# EAGLE design WeatherShield (EAGLE 7.3.0)
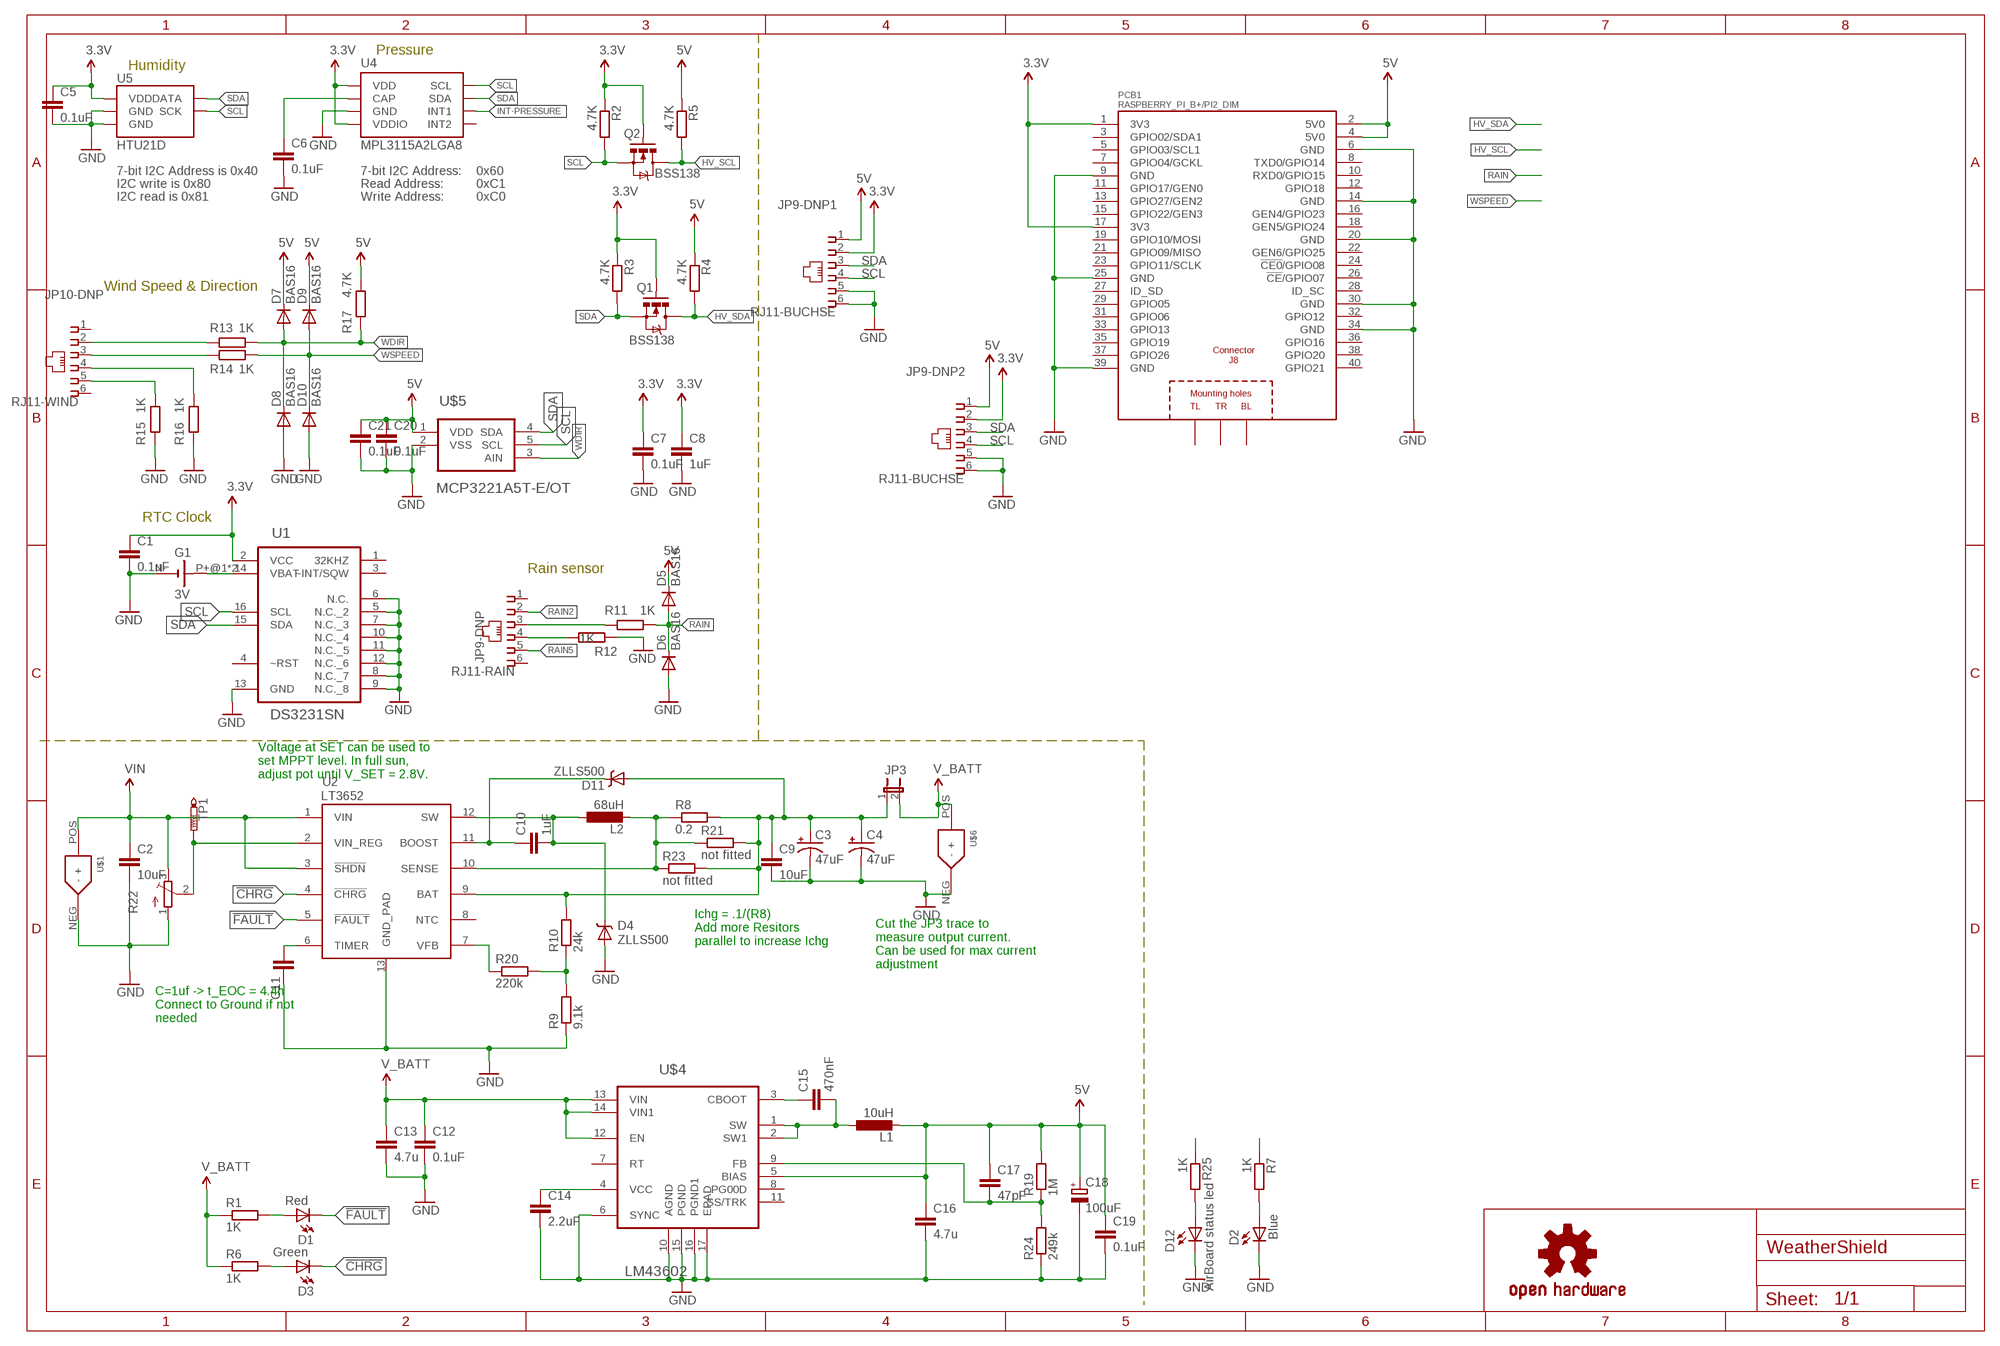
[diagram p0: schematic, sheet 1]

## Parts
C1  0.1uF  C-EUC0603  [C0603]
C2  10uF  C-EUC0603  [C0603]
C3  47uF  47UF-16V-10%(TANT)  [EIA7343-20]
C4  47uF  47UF-16V-10%(TANT)  [EIA7343-20]
C5  0.1uF  C-EUC0603  [C0603]
C6  0.1uF  C-EUC0603  [C0603]
C7  0.1uF  C-EUC0603  [C0603]
C8  1uF  C-EUC0603  [C0603]
C9  10uF  C-EUC0603  [C0603]
C10  1uF  C-EUC0603  [C0603]
C11  1.0uF  C-EUC0603  [C0603]
C12  0.1uF  C-EUC1206  [C1206]
C13  4.7u  C-EUC1206  [C1206]
C14  2.2uF  C-EUC0603  [C0603]
C15  470nF  C-EUC0603  [C0603]
C16  4.7u  C-EUC0603  [C0603]
C17  47pF  C-EUC0603  [C0603]
C18  100uF  CPOL-EUE2,5-6E  [E2,5-6E]
C19  0.1uF  C-EUC1206  [C1206]
C20  0.1uF  C-EUC0603  [C0603]
C21  0.1uF  C-EUC0603  [C0603]
D1  Red  LED0603  [LED-0603]
D2  Blue  LED0603  [LED-0603]
D3  Green  LED0603  [LED-0603]
D4  ZLLS500  ZLLS500ZLLS500  [SOT23]
D5  BAS16  DIODESOD  [SOD-323]
D6  BAS16  DIODESOD  [SOD-323]
D7  BAS16  DIODESOD  [SOD-323]
D8  BAS16  DIODESOD  [SOD-323]
D9  BAS16  DIODESOD  [SOD-323]
D10  BAS16  DIODESOD  [SOD-323]
D11  ZLLS500  ZLLS500ZLLS500  [SOT23]
D12  AirBoard status led  LED0603  [LED-0603]
G1  3V  BATTERY-HOLDER_11.6MM  [CELL_RETAINER_11.6MM]
JP3  JUMPER-PTH-2-NC  [PTH-JUMPER-NC_BOTTOM_NO_SILK]
JP9-DNP  RJ11-RAIN  RJ11-BUCHSE  [RJ11-STECKER]
JP9-DNP1  RJ11-BUCHSE  [RJ11-STECKER]
JP9-DNP2  RJ11-BUCHSE  [RJ11-STECKER]
JP10-DNP  RJ11-WIND  RJ11-BUCHSE  [RJ11-STECKER]
L1  10uH  L-EU6000-XXX-RC  [6000-XXXX-RC]
L2  68uH  L-EU6000-XXX-RC  [6000-XXXX-RC]
LOGO1  OSHW-LOGOM  [OSHW-LOGO-M]
PCB1  RASPBERRY_PI_B+/PI2_DIM  [RASPBERRY_PI_BPLUS_DIM]
Q1  BSS138  MOSFET-NCHANNELSMD  [SOT23-3]
Q2  BSS138  MOSFET-NCHANNELSMD  [SOT23-3]
R1  1K  R-EU_R0603  [R0603]
R2  4.7K  R-EU_R0603  [R0603]
R3  4.7K  R-EU_R0603  [R0603]
R4  4.7K  R-EU_R0603  [R0603]
R5  4.7K  R-EU_R0603  [R0603]
R6  1K  R-EU_R0603  [R0603]
R7  1K  R-EU_R0603  [R0603]
R8  0.2  R-EU_R0805  [R0805]
R9  9.1k  R-EU_R0603  [R0603]
R10  24k  R-EU_R0603  [R0603]
R11  1K  R-EU_R0603  [R0603]
R12  1K  R-EU_R0603  [R0603]
R13  1K  R-EU_R0603  [R0603]
R14  1K  R-EU_R0603  [R0603]
R15  1K  R-EU_R0603  [R0603]
R16  1K  R-EU_R0603  [R0603]
R17  4.7K  R-EU_R0603  [R0603]
R19  1M  R-EU_R0805  [R0805]
R20  220k  R-EU_R0603  [R0603]
R21  not fitted  R-EU_R0805  [R0805]
R22  TRIM_EU-SM-42/43A  [SM-42/43A]
R23  not fitted  R-EU_R0805  [R0805]
R24  249k  R-EU_R0805  [R0805]
R25  1K  R-EU_R0603  [R0603]
TP1  SET  PTR1B1,27  [B1,27]
U1  DS3231SN  [SOIC127P1032X265-16N]
U2  LT3652  [MSOP-12_GND]
U4  MPL3115A2LGA8  [LGA8]
U5  HTU21D  HTU21DSMD  [HTU21D]
U$1  XT-60  [XT-60]
U$4  LM43602  [HTSSOP-16]
U$5  MCP3221A5T-E/OT  [SOT95P270X145-5N]
U$6  XT-60  [XT-60]

## Nets
3.3V: C1.1 C5.1 C7.1 C8.1 JP9-DNP1.2 JP9-DNP2.2 PCB1.1(3V3) PCB1.17(3V3) Q1.1(G) Q2.1(G) R2.1 R3.1 U1.2(VCC) U4.1(VDD) U4.4(VDDIO) U5.VDD
5V: C16.1 C17.1 C18.+ C19.1 C20.1 C21.1 D5.1(C) D7.1(C) D9.1(C) JP9-DNP1.1 JP9-DNP2.1 L1.2 PCB1.2(5V0) PCB1.4(5V0) R4.1 R5.1 R17.1 R19.2 U$4.5(BIAS) U$5.1(VDD)
!CHRG: D3.C U2.4(!CHRG)
!FAULT: D1.C U2.5(!FAULT)
BOOST: C10.1 D11.3(C) U2.11(BOOST)
FB: R9.2 R10.1 R20.2
GND [vcc]: C1.2 C2.2 C3.C(-) C4.C(-) C5.2 C6.2 C7.2 C8.2 C9.2 C11.1 C12.2 C13.2 C14.2 C16.2 C18.- C19.2 C20.2 C21.2 D2.C D4.1(A) D6.2(A) D8.2(A) D10.2(A) D12.C G1.N-(-) JP9-DNP1.5 JP9-DNP1.6 JP9-DNP2.5 JP9-DNP2.6 PCB1.6(GND) PCB1.9(GND) PCB1.14(GND) PCB1.20(GND) PCB1.25(GND) PCB1.30(GND) PCB1.34(GND) PCB1.39(GND) R9.1 R12.2 R15.2 R16.2 R22.1(A) R24.1 U1.5(N.C._2) U1.6(N.C.) U1.7(N.C._3) U1.8(N.C._7) U1.9(N.C._8) U1.10(N.C._4) U1.11(N.C._5) U1.12(N.C._6) U1.13(GND) U2.13(GND_PAD) U4.3(GND) U5.7(GND) U5.GND U$1.NEG(-) U$4.6(SYNC) U$4.10(AGND) U$4.15(PGND) U$4.16(PGND1) U$4.17(EPAD) U$5.2(VSS) U$6.NEG(-)
HV_SCL: Q2.3(D) R5.2
HV_SDA: Q1.3(D) R4.2
INT-PRESSURE: U4.6(INT1)
N$1: JP10-DNP.3 R14.2
N$2: JP10-DNP.2 R13.2
N$3: D1.A R1.2
N$4: JP9-DNP.3 R11.2
N$5: C6.1 U4.2(CAP)
N$6: G1.P+@1(+) G1.P+@2(+) U1.14(VBAT)
N$7: D3.A R6.2
N$10: D2.A R7.2
N$11: JP9-DNP.4 R12.1
N$12: JP10-DNP.5 R15.1
N$13: JP10-DNP.4 R16.1
N$15: R20.1 U2.7(VFB)
N$16: C3.A(+) C4.A(+) C9.1 D11.1(A) JP3.1 R8.2 R10.2 R21.2 R23.2 U2.9(BAT)
N$17: C15.1 U$4.3(CBOOT)
N$22: C17.2 R19.1 R24.2 U$4.9(FB)
N$23: C14.1 U$4.4(VCC)
N$24: C15.2 L1.1 U$4.1(SW) U$4.2(SW1)
N$28: D12.A R25.2
RAIN: D5.2(A) D6.1(C) R11.1
RAIN2: JP9-DNP.2
RAIN5: JP9-DNP.5
SCL: JP9-DNP1.4 JP9-DNP2.4 Q2.2(S) R2.2 U1.16(SCL) U4.8(SCL) U5.SCK U$5.5(SCL)
SDA: JP9-DNP1.3 JP9-DNP2.3 Q1.2(S) R3.2 U1.15(SDA) U4.7(SDA) U5.DATA U$5.4(SDA)
SENSE: L2.2 R8.1 R21.1 R23.1 U2.10(SENSE)
SET: R22.2(S) TP1.TP U2.2(VIN_REG)
STAT1: R25.1
STAT3: R7.1
SW: C10.2 D4.3(C) L2.1 U2.12(SW)
TIMER: C11.2 U2.6(TIMER)
V_BATT: C12.1 C13.1 JP3.2 R1.1 R6.1 U$4.12(EN) U$4.13(VIN) U$4.14(VIN1) U$6.POS(+)
VIN: C2.1 R22.3(E) U2.1(VIN) U2.3(!SHDN) U$1.POS(+)
WDIR: D7.2(A) D8.1(C) R13.1 R17.2 U$5.3(AIN)
WSPEED: D9.2(A) D10.1(C) R14.1
Unconnected: JP9-DNP.1 JP9-DNP.6 JP10-DNP.1 JP10-DNP.6 PCB1.3(GPIO02/SDA1) PCB1.5(GPIO03/SCL1) PCB1.7(GPIO04/GCKL) PCB1.8(TXD0/GPIO14) PCB1.10(RXD0/GPIO15) PCB1.11(GPIO17/GEN0) PCB1.12(GPIO18) PCB1.13(GPIO27/GEN2) PCB1.15(GPIO22/GEN3) PCB1.16(GEN4/GPIO23) PCB1.18(GEN5/GPIO24) PCB1.19(GPIO10/MOSI) PCB1.21(GPIO09/MISO) PCB1.22(GEN6/GPIO25) PCB1.23(GPIO11/SCLK) PCB1.24(!CE0!/GPIO08) PCB1.26(!CE!/GPIO07) PCB1.27(ID_SD) PCB1.28(ID_SC) PCB1.29(GPIO05) PCB1.31(GPIO06) PCB1.32(GPIO12) PCB1.33(GPIO13) PCB1.35(GPIO19) PCB1.36(GPIO16) PCB1.37(GPIO26) PCB1.38(GPIO20) PCB1.40(GPIO21) PCB1.PE_BL(BL) PCB1.PE_TL(TL) PCB1.PE_TR(TR) U1.1(32KHZ) U1.3(~INT/SQW) U1.4(~RST) U2.8(NTC) U4.5(INT2) U$4.7(RT) U$4.8(PG00D) U$4.11(SS/TRK)

## Notes on the sheet
- Pressure
- Humidity
- 7-bit I2C Address is 0x40 | 7-bit I2C Address: | 0x60
- I2C write is 0x80 | Read Address: | 0xC1
- I2C read is 0x81 | Write Address: | 0xC0
- Wind Speed & Direction
- RTC Clock
- Rain sensor
- Voltage at SET can be used to
  set MPPT level. In full sun,
  adjust pot until V_SET = 2.8V.
- Ichg = .1/(R8)
  Add more Resitors 
  parallel to increase Ichg
- Cut the JP3 trace to
  measure output current.
  Can be used for max current
  adjustment
- C=1uf -> t_EOC = 4.4h
  Connect to Ground if not 
  needed

## Library data of the parts
C1 C2 C5-C17 C19-C21 = rcl:C-EU: CAPACITOR, European symbol
C3 C4 = FSEWeatherShield:47UF-16V-10%(TANT)
C18 = rcl:CPOL-EU: POLARIZED CAPACITOR, European symbol
D1-D3 D12 = SparkFun:LED: LEDs Standard schematic elements and footprints for 5mm, 3mm, 1206, and 0603 sized LEDs. 5mm - Spark Fun Electronics SKU : COM-00529 (and others)
D4 D11 = SparkFun-DiscreteSemi:ZLLS500: 700mA 40V SOT-23 Schottky; PROD_ID: DIO-08411
D5-D10 = SparkFun:DIODE: Diode These are standard reverse protection diodes and small signal diodes. SMA package can handle up to about 1A. SOD-323 can handle about 200mA. What the SOD-323 package when ordering, there are some mfgs out there that are 5-pin packages.
G1 = battery:BATTERY-HOLDER_11.6MM: 11.6mm PC BUTTON CELL RETAINER, high 5.97mm KEYSTONE ELECTRONICS CORP. Data sheet <http://www.farnell.com/cad/1718310.pdf>; MF: KEYSTONE; MPN: 2997; OC_FARNELL: 2293265
JP3 = SparkFun-Passives:JUMPER-PTH-2-NC
JP9-DNP JP9-DNP1 JP9-DNP2 JP10-DNP = FSEWeatherShield:RJ11-BUCHSE
L1 L2 = rcl:L-EU: INDUCTOR, European symbol
LOGO1 = SparkFun-Aesthetics:OSHW-LOGO: Open Source Hardware Logo This logo indicates the piece of hardware it is found on incorporates a OSHW license and/or adheres to the definition of open source hardware found here: http://freedomdefined.org/OSHW
PCB1 = FSE_Weather_Shield:RASPBERRY_PI_B+/PI2: Raspberry Pi B+ Basedon issue: Thursday, July 10, 2014 - Rev 1.2 LBR by Tim Rettmann 07-2014
Q1 Q2 = SparkFun:MOSFET-NCHANNEL
R1-R17 R19-R21 R23-R25 = rcl:R-EU_: RESISTOR, European symbol
R22 = pot:TRIM_EU-: POTENTIOMETER
TP1 = testpad:PTR1: TEST PIN
U1 = FSE_Weather_Shield:DS3231SN: Extremely Accurate I2C-Integrated RTC/TCXO/Crystal; MPN: DS3231SN#; OC_FARNELL: 1593292; OC_NEWARK: 68K3406; PACKAGE: SOIC-16; SUPPLIER: Maxim
U2 = SparkFun-PowerIC:LT3652: LT3652 MPPT Solar Charge Controller 5V-32V smart charger for batteries up to 14.4V
U4 = SparkFun-Sensors:MPL3115A2: Altimeter/Pressure Sensor, I2C, 1.95V-3.6V supply, 50 to 110kPa
U5 = SparkFun-Sensors:HTU21D
U$1 U$6 = FSEWeatherShield:XT-60
U$4 = FSEWeatherShield:LM43602
U$5 = FSEWeatherShield:MCP3221A5T-E/OT: A/D Converter; MPN: MCP3221A5T-E/OT; OC_FARNELL: 1332098; OC_NEWARK: 34M7446; PACKAGE: SOT-5; SUPPLIER: Microchip

## Net classes
1 vcc: width 0.203 mm

## Board
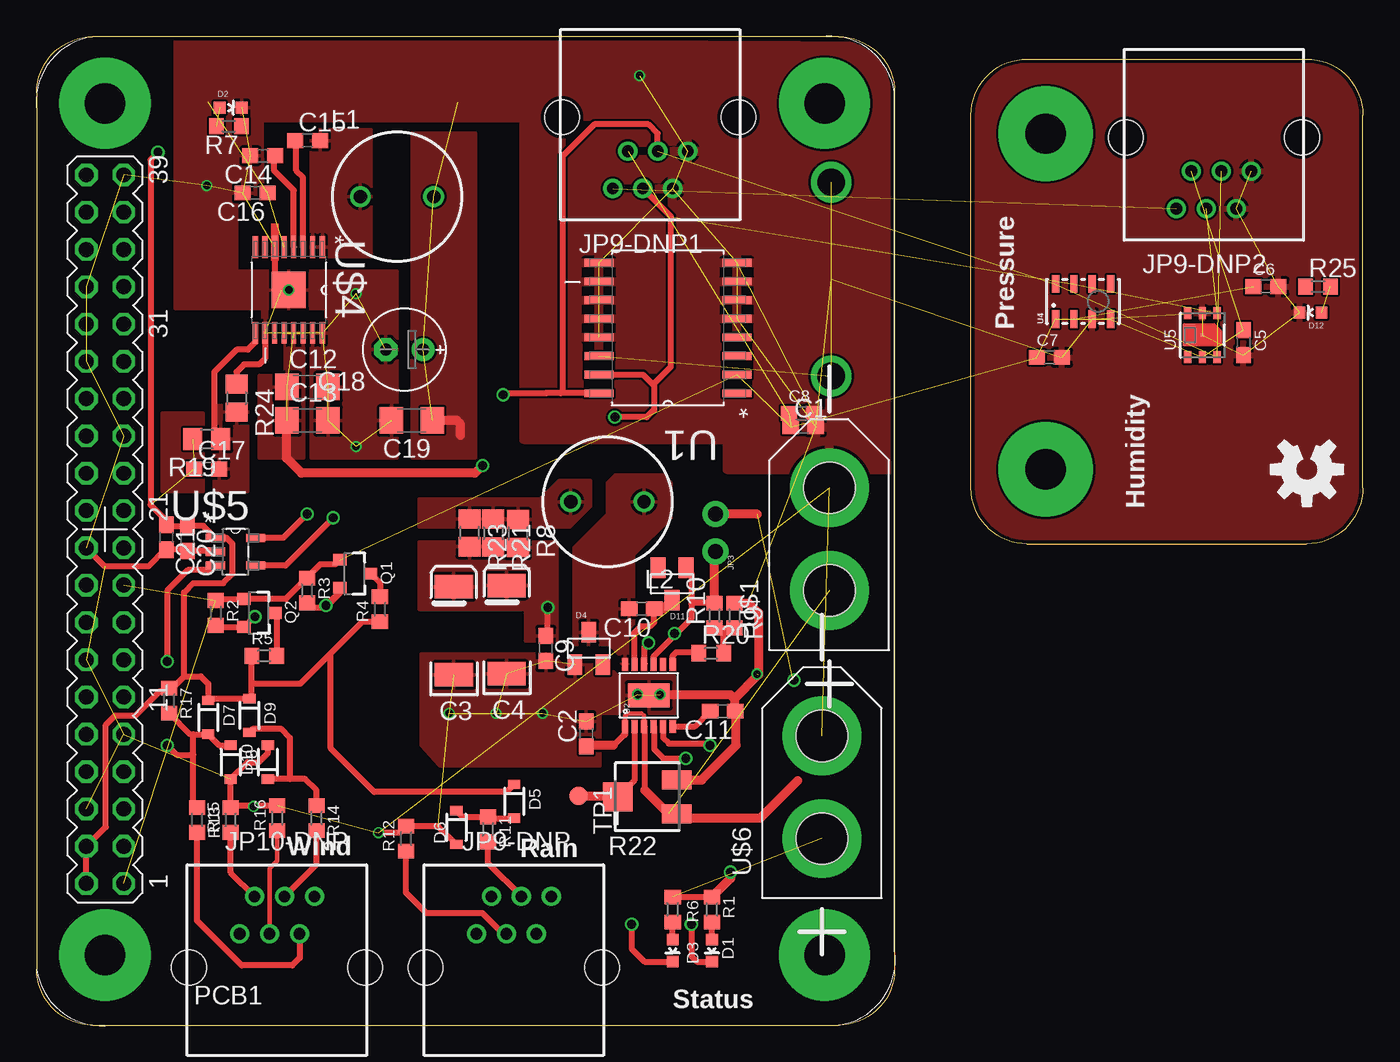
[diagram p1: board, top side]
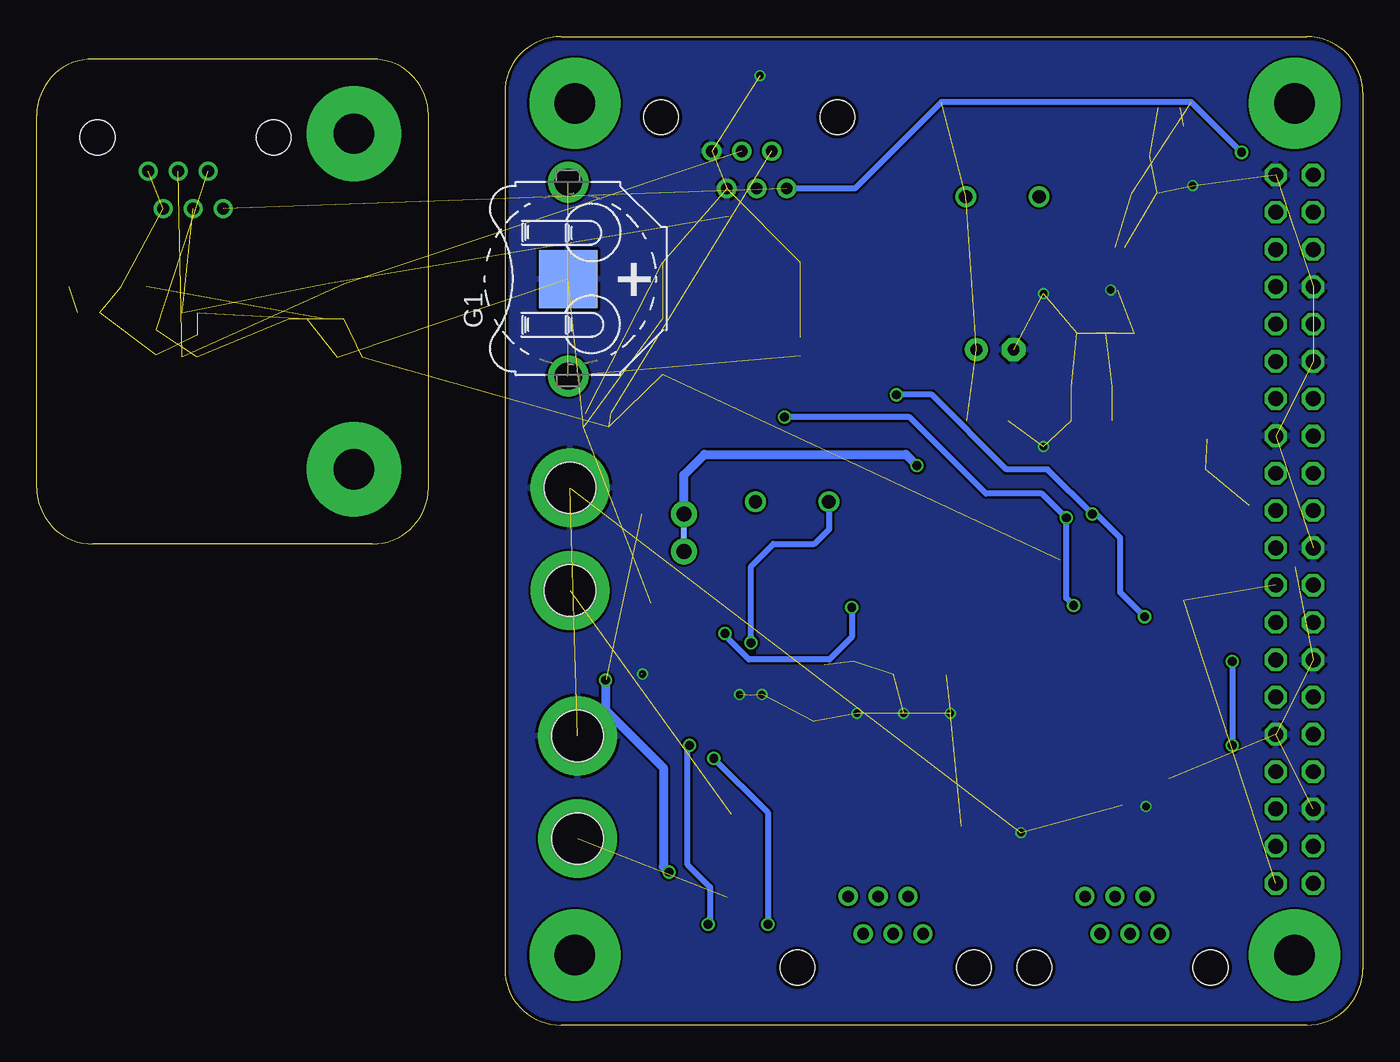
[diagram p2: board, bottom side, seen from below]

Size 90.3 x 67.31 mm. Coordinates in mm from the lower left corner, seen from the top.
Outline: 67.44,65.79 86.49,65.79 arc-90 90.3,61.98 90.3,36.58 arc-90 86.49,32.77 67.44,32.77 arc-90 63.63,36.58 63.63,61.98 arc-90 67.44,65.79
Outline: 3.81,0 arc-90 0,3.81 0,63.5 arc-90 3.81,67.31 54.61,67.31 arc-90 58.42,63.5 58.42,3.81 arc-90 54.61,0 3.81,0
Copper layers (1*16): Top 0.018mm / dielectric 1.55mm / Bottom 0.018mm
Design rules "eC_2Layer_PClass6_BaseCopperO18_eCDefault": minimum track width 0.15mm, minimum drill 0.35mm, track to track 0.15mm, track to pad 0.15mm, pad to pad 0.15mm, via to via 0.15mm, smd to smd 0mil, copper to edge 0.25mm, drill to drill 0.35mm, minimum pad ring 0.175mm, minimum via ring 0.125mm, stop-mask expansion 0mil, vias tented up to drill 0.45mm, thermal gap 0.2mm

### Footprints (pad centres in the part's own frame; a part is rotated, then mirrored left to right if it is on the bottom)
C0603 = smd 1.1 x 1: 1 -0.85,0; 2 0.85,0
EIA7343-20 = smd 1.6 x 2.6: A 3,0; C -3,0
C1206 = smd 1.6 x 1.8: 1 -1.4,0; 2 1.4,0
E2,5-6E = drill 0.813 pad 1.575: + -1.27,0 | drill 0.813 pad 1.575 octagon: - 1.27,0
LED-0603 = smd 0.8 x 0.8: A 0,-0.75; C 0,0.75
SOT23 = smd 1 x 1.4: 1 -0.95,-1.1; 2 0.95,-1.1; 3 0,1.1
SOD-323 = smd 0.63 x 0.83: 1 -1.15,0; 2 1.15,0
CELL_RETAINER_11.6MM = smd 3.96 x 3.96: N- 0,0 | drill 1.85 pad 2.54: P+@1 -6.605,0; P+@2 6.605,0
PTH-JUMPER-NC_BOTTOM_NO_SILK = drill 1.016 pad 1.778: 1 -1.27,0; 2 1.27,0 | smd 1.27 x 0.381 bottom: P$1 0,0
RJ11-STECKER = drill 0.8 pad 1.3: 1 8.65,10.84; 2 7.63,8.3; 3 6.61,10.84; 4 5.59,8.3; 5 4.57,10.84; 6 3.55,8.3 | hole 2.36: 0.1,6; 12.1,6
6000-XXXX-RC = drill 0.9 pad 1.422: 1 -2.5,0; 2 2.5,0
RASPBERRY_PI_BPLUS_DIM = drill 1.016 octagon: 1 9.64,52.5; 2 9.64,55.04; 3 12.18,52.5; 4 12.18,55.04; 5 14.72,52.5; 6 14.72,55.04; 7 17.26,52.5; 8 17.26,55.04; 9 19.8,52.5; 10 19.8,55.04; 11 22.34,52.5; 12 22.34,55.04; 13 24.88,52.5; 14 24.88,55.04; 15 27.42,52.5; 16 27.42,55.04; 17 29.96,52.5; 18 29.96,55.04; 19 32.5,52.5; 20 32.5,55.04; 21 35.04,52.5; 22 35.04,55.04; 23 37.58,52.5; 24 37.58,55.04; 25 40.12,52.5; 26 40.12,55.04; 27 42.66,52.5; 28 42.66,55.04; 29 45.2,52.5; 30 45.2,55.04; 31 47.74,52.5; 32 47.74,55.04; 33 50.28,52.5; 34 50.28,55.04; 35 52.82,52.5; 36 52.82,55.04; 37 55.36,52.5; 38 55.36,55.04; 39 57.9,52.5; 40 57.9,55.04 | drill 2.75 pad 6.2: PE_BL 4.77,4.77; PE_TL 4.77,53.77; PE_TR 62.77,53.77; PE_TR1 62.77,4.77
SOT23-3 = smd 0.8 x 0.9: 1 -0.95,-1; 2 0.95,-1; 3 0,1.1
R0603 = smd 1 x 1.1: 1 -0.85,0; 2 0.85,0
R0805 = smd 1.3 x 1.5: 1 -0.95,0; 2 0.95,0
SM-42/43A = smd 2 x 1.3: 1 2,1.15; 3 2,-1.15 | smd 2 x 2: 2 -2,0
B1,27 = smd 1.27 x 1.27: TP 0,0
SOIC127P1032X265-16N = smd 1.981 x 0.533: 1 -4.699,4.445; 2 -4.699,3.175; 3 -4.699,1.905; 4 -4.699,0.635; 5 -4.699,-0.635; 6 -4.699,-1.905; 7 -4.699,-3.175; 8 -4.699,-4.445; 9 4.699,-4.445; 10 4.699,-3.175; 11 4.699,-1.905; 12 4.699,-0.635; 13 4.699,0.635; 14 4.699,1.905; 15 4.699,3.175; 16 4.699,4.445
MSOP-12_GND = smd 0.889 x 0.42: 1 -2.1,1.625; 2 -2.1,0.975; 3 -2.1,0.325; 4 -2.1,-0.325; 5 -2.1,-0.975; 6 -2.1,-1.625; 7 2.1,-1.625; 8 2.1,-0.975; 9 2.1,-0.325; 10 2.1,0.325; 11 2.1,0.975; 12 2.1,1.625 | smd 1.651 x 2.845: 13 0,0
LGA8 = smd 1.2 x 0.5: 1 -1.2,1.875; 2 -1.2,0.625; 3 -1.2,-0.625; 4 -1.2,-1.875; 5 1.2,-1.875; 6 1.2,-0.625; 7 1.2,0.625; 8 1.2,1.875
HTU21D = smd 0.2 x 0.2: 7 0,0 | smd 0.8 x 0.5: DATA 1.5,-1; GND 1.5,0; NC@1 -1.5,1; NC@6 1.5,1; SCK -1.5,-1; VDD -1.5,0
XT-60 = drill 3.58: NEG 7,0; POS 0,0 | hole 3.5: 0,0; 7,0
HTSSOP-16 = smd 1.473 x 0.356: 1 -2.921,2.286; 2 -2.921,1.626; 3 -2.921,0.965; 4 -2.921,0.33; 5 -2.921,-0.33; 6 -2.921,-0.965; 7 -2.921,-1.626; 8 -2.921,-2.286; 9 2.921,-2.286; 10 2.921,-1.626; 11 2.921,-0.965; 12 2.921,-0.33; 13 2.921,0.33; 14 2.921,0.965; 15 2.921,1.626; 16 2.921,2.286 | smd 2.464 x 2.311: 17 0,0
SOT95P270X145-5N = smd 1.321 x 0.559: 1 -1.372,0.94; 2 -1.372,0; 3 -1.372,-0.94; 4 1.372,-0.94; 5 1.372,0.94

### Placement (x,y rotation side)
C1  52.2,40.74 0 top
C2  37.41,19.84 90 top
C3  28.4,26.85 90 top
C4  32,26.92 90 top
C5  82.17,46.48 270 top
C6  83.69,50.29 0 top
C7  68.96,45.47 0 top
C8  52.07,41.66 0 top
C9  34.67,25.65 270 top
C10  41.2,28.35 180 top
C11  46.71,21.39 180 top
C12  18.44,43.46 0 top
C13  18.44,41.17 0 top
C14  15.39,59.21 180 top
C15  18.44,60.22 0 top
C16  14.88,56.67 180 top
C17  11.58,37.87 0 top
C18  25.04,46 180 top
C19  25.55,41.17 180 top
C20  10.26,33.15 270 top
C21  8.84,33.22 270 top
D1  45.97,5.08 180 top
D2  13.21,62.48 270 top
D3  43.31,5.08 180 top
D4  37.59,25.65 0 top
D5  32.51,15.24 270 top
D6  28.57,13.46 270 top
D7  11.68,20.95 270 top
D8  13.21,17.91 270 top
D9  14.48,21.08 270 top
D10  15.75,17.91 90 top
D11  43.26,30.05 180 top
D12  86.74,48.51 90 top
G1  54.1,50.8 90 bottom
JP3  46.23,33.53 90 top
JP9-DNP  26.39,-2.08 0 top
JP9-DNP1  47.88,67.82 180 top
JP9-DNP2  86.26,66.45 180 top
JP10-DNP  10.26,-2.08 0 top
L1  24.54,56.41 0 top
L2  38.86,35.64 180 top
LOGO1  86.49,37.85 180 top
PCB1  58.42,0 90 top
Q1  21.64,30.73 270 top
Q2  15.11,28.07 270 top
R1  45.97,7.87 270 top
R2  12.19,28.07 270 top
R3  18.41,29.59 270 top
R4  23.37,28.32 90 top
R5  15.49,25.15 0 top
R6  43.31,7.87 270 top
R7  13.08,61.21 180 top
R8  32.77,33.48 270 top
R9  47.52,27.89 270 top
R10  46.15,27.89 90 top
R11  30.73,13.34 270 top
R12  25.15,12.7 90 top
R13  10.92,13.97 270 top
R14  19.05,14.1 270 top
R15  13.21,13.97 90 top
R16  16.38,14.1 90 top
R17  9.02,22.1 270 top
R19  11.58,39.9 180 top
R20  45.92,25.32 0 top
R21  31.09,33.5 270 top
R22  41.58,15.54 0 top
R23  29.46,33.53 270 top
R24  13.61,42.7 270 top
R25  87.25,50.29 0 top
TP1  36.88,15.62 270 top
U1  42.98,47.47 180 top
U2  41.68,22.45 90 top
U4  71.25,49.28 90 top
U5  79.38,46.99 90 top
U$1  53.98,29.59 90 top
U$4  17.17,50.06 270 top
U$5  13.54,32.23 0 top
U$6  53.47,12.7 90 top

### Tracks (layer width: path | path; a pad name or v marks a point on that pad's centre or on a via)
3.3V  (12 unrouted)
  Top 0.406: R2.1 12.29,29.02 Q2.1 16.95,29.02 18.41,30.48 | Q1.1 20.33,31.37 19.3,31.37 18.41,30.48 | 18.41,30.48 R3.1
5V  (via drill 0.6)  (8 unrouted)
  Top 0.406: PCB1.2 PCB1.4 4.7,13.5 4.7,20.45 5.33,21.08 6.73,21.08 8.38,22.73 8.8,22.73 | 14.64,23.24 14.64,22.4 D9.1 11.81,22.23 D7.1 11.68,23.24 11.18,23.75 10.03,23.75 | 14.64,23.24 R5.1 | 14.64,23.24 17.95,23.24 20.02,25.32 | 9.27,22.95 R17.1 | 20.02,25.32 22.18,27.47 R4.1 | 10.03,23.75 10.03,29.46 10.67,30.1 12.7,30.1 13.34,30.73 13.34,32.77 12.93,33.17 U$5.1 11.34,34 C20.1 8.91,34 C21.1 8.84,34.34 7.75,35.43 7.75,58.93 v8.26,59.44 | 10.03,23.75 9.4,23.11 | 9.4,23.11 9.23,22.95 | 9.23,22.95 R17.1 | R17.1 9.02,23.11 9.4,23.11 | 8.8,22.73 R17.1 | 8.8,22.73 9.02,22.73 9.23,22.95 | D5.1 32,15.88 22.99,15.88 20.02,18.84 20.02,25.32
  Bottom 0.406: v8.26,59.44 11.68,62.87 28.7,62.87 34.59,56.98 JP9-DNP1.1
!CHRG  (via drill 0.6)
  Top 0.406: U2.4 42.04,20.32 42.04,18.8 42.67,18.16 v44.2,18.16 | v40.51,6.86 40.51,5.21 41.4,4.32 43.3,4.32 D3.C
  Bottom 0.406: v44.2,18.16 40.51,14.48 v40.51,6.86
!FAULT  (via drill 0.6)
  Top 0.406: U2.5 42.66,19.57 43.05,19.18 45.72,19.18 v45.85,19.05 | v44.58,6.86 44.58,4.7 44.96,4.32 45.96,4.32 D1.C
  Bottom 0.406: v44.58,6.86 44.45,6.99 44.45,9.4 45.97,10.92 45.97,18.92 v45.85,19.05
+5V
  Top 0.61: 28.85,40.16 28.85,40.92 28.6,41.17 26.82,41.17
  pour Top: 25.55,38.63 25.55,60.73 29.87,60.73 29.87,38.63
  pour Top: 11.33,41.68 11.33,36.35 8.53,36.35 8.53,41.68
BOOST
  Top 0.406: U2.11 40.71,26.74 41.15,27.18 41.78,27.18 42.04,27.43 42.04,28.34 C10.1
  Top 0.61: C10.1 42.65,28.35 D11.3
FB
  Top 0.406: R10.1 46.99,27.04 | 46.99,27.04 R9.2 | R20.2 46.77,26.82 46.99,27.04
GND  (via drill 0.5 pad 0.25)  (61 unrouted)
  Top 0.406: U$4.6 16.2,50.52 16.66,50.06 U$4.17 | U$4.10 15.54,45.39 15.14,44.98 14.12,44.98 13.61,44.48 R24.1 | U$5.2 12.1,32.3 C20.2 10.19,32.37 C21.2 8.75,32.37 7.62,31.24 4.64,31.24 PCB1.20 | D10.2 15.75,18.54 15.11,17.91 14.36,17.91 D8.2 R15.2 13.34,14.95 14.7,14.95 | 14.7,14.95 R16.2 | 14.7,14.95 v14.76,14.88 | D6.2 27.34,13.55 R12.2 24.7,13.11 v23.27,13.11
  Top 0.61: R22.1 45.27,16.7 47.62,19.05 47.62,21.32 C11.1 47.5,21.45 47.5,22.23 | v42.44,22.5 47.22,22.5 47.5,22.23 | R9.1 48.48,28.74 49.15,28.07 49.15,23.88 47.5,22.23
  other vias: 17.17,50.06 21.74,39.4 21.74,49.81 11.58,57.18 41.05,64.67 28.09,21.23 31.27,21.23 34.44,21.23 40.92,22.5 49.05,23.9
  pour Bottom: -1.27,68.58 59.69,68.58 59.69,-1.27 -1.27,-1.27
  pour Top: 62.36,32.77 62.61,66.04 90.55,66.04 90.3,32.77
  pour Top: 18.69,47.78 18.69,38.63 24.54,38.63 24.54,51.33 13.61,51.33 13.61,56.67 15.39,56.54 15.37,61.59 34.32,61.57 34.32,67.08 9.42,67.08 9.42,48.79 15.39,48.79 15.39,47.78 15.65,47.78 15.65,48.79 19.71,48.79 19.71,47.78
  pour Top: 43.43,21.21 43.43,23.75 39.62,23.75 38.86,24.51 35.81,24.51 35.05,25.27 26.16,25.27 26.16,19.05 27.43,17.65 38.35,17.65 38.35,21.21
  pour Top: 33.15,66.8 33.15,39.88 46.99,39.88 46.99,37.85 58.29,37.85 58.29,66.67
HV_SCL
  Top 0.406: Q2.3 16.34,27.94 R5.2
HV_SDA
  Top 0.406: Q1.3 23.37,30.11 R4.2
N$1
  Top 0.406: JP10-DNP.3 19.05,10.94 R14.2
N$2
  Top 0.406: JP10-DNP.2 17.91,6.2 17.91,4.57 17.4,4.06 13.97,4.06 10.92,7.11 R13.2
N$3
  Top 0.406: D1.A R1.2
N$4
  Top 0.406: JP9-DNP.3 30.73,11.02 R11.2
N$5  (1 unrouted)
N$6  (2 unrouted)
N$7
  Top 0.406: D3.A R6.2
N$8  (via drill 2.75 pad 6.45)
  other vias: 68.71,37.85
N$9  (via drill 2.75 pad 6.45)
  other vias: 68.71,60.71
N$10  (1 unrouted)
N$11
  Top 0.406: JP9-DNP.4 31.76,6.22 30.35,7.62 26.54,7.62 25.15,9.02 R12.1
N$12
  Top 0.406: JP10-DNP.5 13.21,10.38 R15.1
N$13
  Top 0.305: JP10-DNP.4 15.88,6.24 15.88,10.67 16.38,11.18 R16.1
N$15
  Top 0.406: U2.7 43.31,25.15 43.56,25.4 45,25.4 R20.1
N$16  (via drill 0.6)  (1 unrouted)
  Top 0.406: U2.9 42.01,25.11 44.58,27.69 44.58,28.7 | D11.1 44.58,30.78 44.58,28.7 | R10.2 44.61,28.74 44.58,28.7 | C9.1 34.8,26.5 v34.8,28.45
  Top 0.61: R10.2 46.15,32.18 JP3.1
  Bottom 0.406: v34.8,28.45 34.8,26.42 36.32,24.89 41.78,24.89 42.01,25.11 43.5,26.61 v43.43,26.67
  pour Top: 26.04,28.32 26.04,32.89 35.43,32.89 35.43,26.16 33.27,26.16 33.27,28.32
N$17
  Top 0.406: U$4.3 18.14,57.73 17.68,58.19 17.68,60.13 C15.1
N$22
  Top 0.406: 13.55,41.68 R24.2 | U$4.9 14.88,46.51 14.38,46 13.61,46 12.09,44.48 12.09,40.34 R19.1
  pour Top: 14.38,42.19 12.09,42.19 12.09,36.35 14.38,36.35
N$23
  Top 0.406: U$4.4 17.5,56.84 16.15,58.19 16.15,59.12 C14.1
N$24
  pour Top: 18.69,52.35 18.69,60.99 22.76,60.99 22.76,52.35
N$28  (1 unrouted)
RAIN
  Top 0.406: D6.1 29,14.19 R11.1 30.83,14.09 D5.2
SCL  (via drill 0.6)  (3 unrouted)
  Top 0.406: 31.85,43.03 34.7,43.03 | v18.41,34.8 16.79,33.17 U$5.5 | R2.2 12.29,27.12 Q2.2 14.81,27.81 v14.86,27.81 | U1.16 35.69,43.03 | 35.69,43.03 34.7,43.03 | 34.7,43.03 34.67,43.05 | JP9-DNP1.4 42.29,60.71 41.66,61.34 37.97,61.34 35.81,59.18 35.81,43.16 35.69,43.03
  Top 0.61: v31.75,42.93 31.85,43.03
  Bottom 0.406: v31.75,42.93 29.34,42.93 24.26,37.85 21.46,37.85 v18.41,34.8 18.14,34.8 16.51,33.17 16.51,29.46 v14.86,27.81
SDA  (via drill 0.6)  (3 unrouted)
  Top 0.406: U$5.4 16.94,31.29 v20.19,34.54 | 38.3,44.32 U1.15 41.3,44.3 41.91,43.69 | R3.2 18.71,28.45 19.68,28.45 20.64,29.4 Q1.2 20.89,29.78 v19.68,28.57 | 41.91,43.69 42.04,43.56 42.04,41.91 41.53,41.4 v39.37,41.4 | 41.91,43.69 42.04,43.69 43.18,44.83 43.18,55.07 JP9-DNP1.3
  Bottom 0.406: v39.37,41.4 30.86,41.4 25.65,36.2 21.84,36.2 v20.19,34.54 20.19,29.08 v19.68,28.57
SENSE  (via drill 0.6)
  Top 0.406: U2.10 41.4,24.6 41.4,25.78 v41.66,26.04
  Bottom 0.406: v41.66,26.04 41.66,31.24 40.13,32.77 37.34,32.77 36.32,33.78 36.32,35.6 L2.2
  pour Top: 26.04,33.91 36.32,33.91 37.72,35.31 37.72,37.08 35.56,37.08 34.29,35.81 26.04,35.81
SET
  Top 0.406: U2.2 40.71,16.67 R22.2
  Top 0.61: TP1.TP 39.5,15.62 R22.2
SW
  pour Top: 39.83,24.61 39.83,25.07 38.99,25.91 36.58,25.91 36.58,32.51 38.86,34.8 38.86,36.96 39.37,37.47 42.67,37.47 43.18,36.96 43.18,34.54 40.64,32 40.64,26.04 40.26,25.65 40.26,24.64 39.88,24.64
TIMER
  Top 0.406: U2.6 44.83,20.35 C11.2
V_BATT  (via drill 0.6)  (6 unrouted)
  Top 0.406: R6.1 R1.1
  Top 0.61: 49.07,34.8 JP3.2 | v30.35,38.1 29.84,37.59 18.03,37.59 17.02,38.61 17.02,41.15 C13.1 | 51.51,23.55 v51.56,23.5 | v47.24,10.41 47.24,9.99 R1.1
  Bottom 0.61: JP3.2 46.23,37.47 44.83,38.86 31.11,38.86 v30.35,38.1 | v51.56,23.5 51.56,21.46 47.62,17.53 47.62,10.79 v47.24,10.41
  pour Top: 18.19,47.78 18.19,38.63 15.14,38.63 15.14,44.22 16.92,44.22 16.92,47.78
VIN  (1 unrouted)
  Top 0.305: 41.4,20.4 U2.3 41.35,21.08 41.2,21.23 40.23,21.23 40.06,21.06 U2.1
  Top 0.406: 44.04,14.35 R22.3 | 40.06,20.12 U2.1 40.06,19.74 39.95,19.74 39.27,19.05 | U2.3 41.4,20.31 41.4,16
  Top 0.61: C2.1 37.48,19.05 39.27,19.05 | 43.54,14.35 R22.3 43.01,14.39 41.4,16 | 44.04,14.35 44.3,14.1 49.28,14.1 51.82,16.64
WDIR  (via drill 0.6)
  Top 0.406: R17.2 10.46,19.8 10.67,19.8 | 10.67,19.8 D7.2 12.43,19.06 D8.1 | R13.1 10.67,15.07 10.67,18.41 | 10.67,18.41 10.67,19.8 | U$5.3 11.86,30.99 10.29,30.99 8.89,29.59 v8.89,24.77 | v8.89,19.05 9.53,18.41 10.67,18.41
  Bottom 0.406: v8.89,24.77 v8.89,19.05
WSPEED
  Top 0.406: 17.24,16.76 D10.1 | D9.2 14.74,20.19 16.64,20.19 17.24,19.59 17.24,16.76 | R14.1 19.05,16 18.29,16.76 17.25,16.76 17.24,16.76
(copper drawn outside any net)
  shapes: Top area x1

### Text on the board
tPlace: FSE Weather Shield V1 | Pressure | Humidity | Wind | Rain | Status
tValues: N. Seidle